# EAGLE design board (EAGLE 9.6.2)
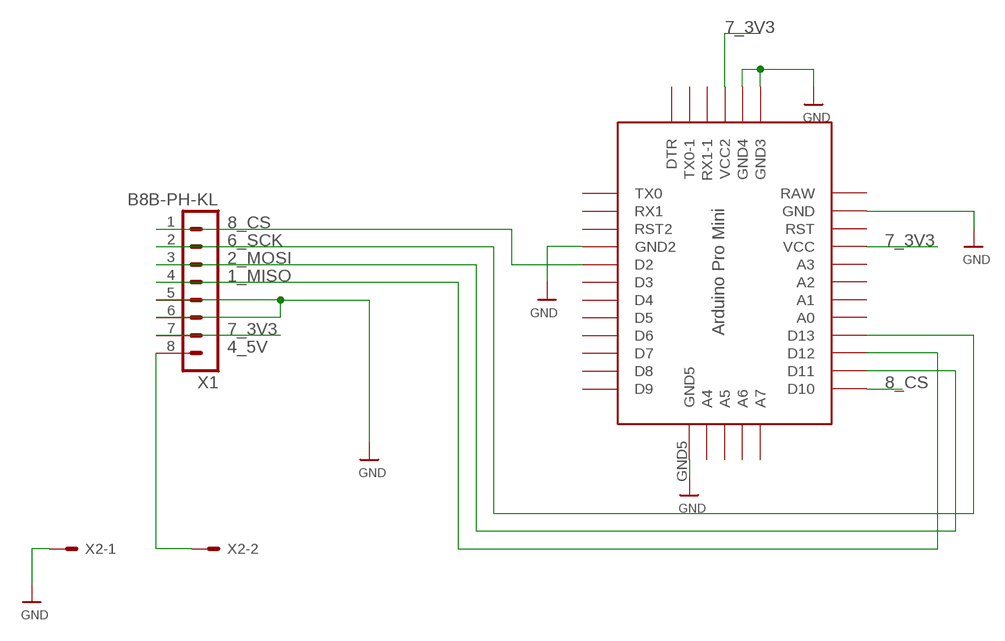
[diagram p0: schematic, sheet 1]

## Parts
U$7  PRO-MINI_5BOT  [PRO-MINI-5BOT]
X1  B8B-PH-KL  [B8B-PH-K-S]
X2  87758-0216  [87758-0216]

## Nets
1_MISO: U$7.D12 X1.4
2_MOSI: U$7.D11 X1.3
4_5V: X1.8 X2.2
6_SCK: U$7.D13 X1.2
7_3V3: U$7.VCC U$7.VCC2 X1.7
8_CS: U$7.D2 U$7.D10 X1.1
GND: U$7.GND U$7.GND2 U$7.GND3 U$7.GND4 U$7.GND5 X1.5 X1.6 X2.1
Unconnected: U$7.A0 U$7.A1 U$7.A2 U$7.A3 U$7.A4 U$7.A5 U$7.A6 U$7.A7 U$7.D3 U$7.D4 U$7.D5 U$7.D6 U$7.D7 U$7.D8 U$7.D9 U$7.DTR U$7.RST U$7.RST2 U$7.RX1 U$7.RX1-1 U$7.TX0 U$7.TX0-1

## Power pins joined to a net without a drawn wire
RAW: U$7.RAW

## Library data of the parts
U$7 = Arduino-clone:PRO-MINI_5BOT: 5 pins at bottom
X1 = con-JST PH:B8B-PH: JST PH series header 2.00mm pitch disconnectable crimp style connectors, vertical (side entry type), 8 pins
X2 = con-molex:87758-0216: 2 Pin - 2mm Dual Row Single Wafer, Vertical T/H HDR Source: http://www.molex.com/pdm_docs/sd/877580616_sd.pdf; MF: MOLEX; MPN: 87758-0216; OC_FARNELL: unknown; OC_NEWARK: 94M1513

## Board
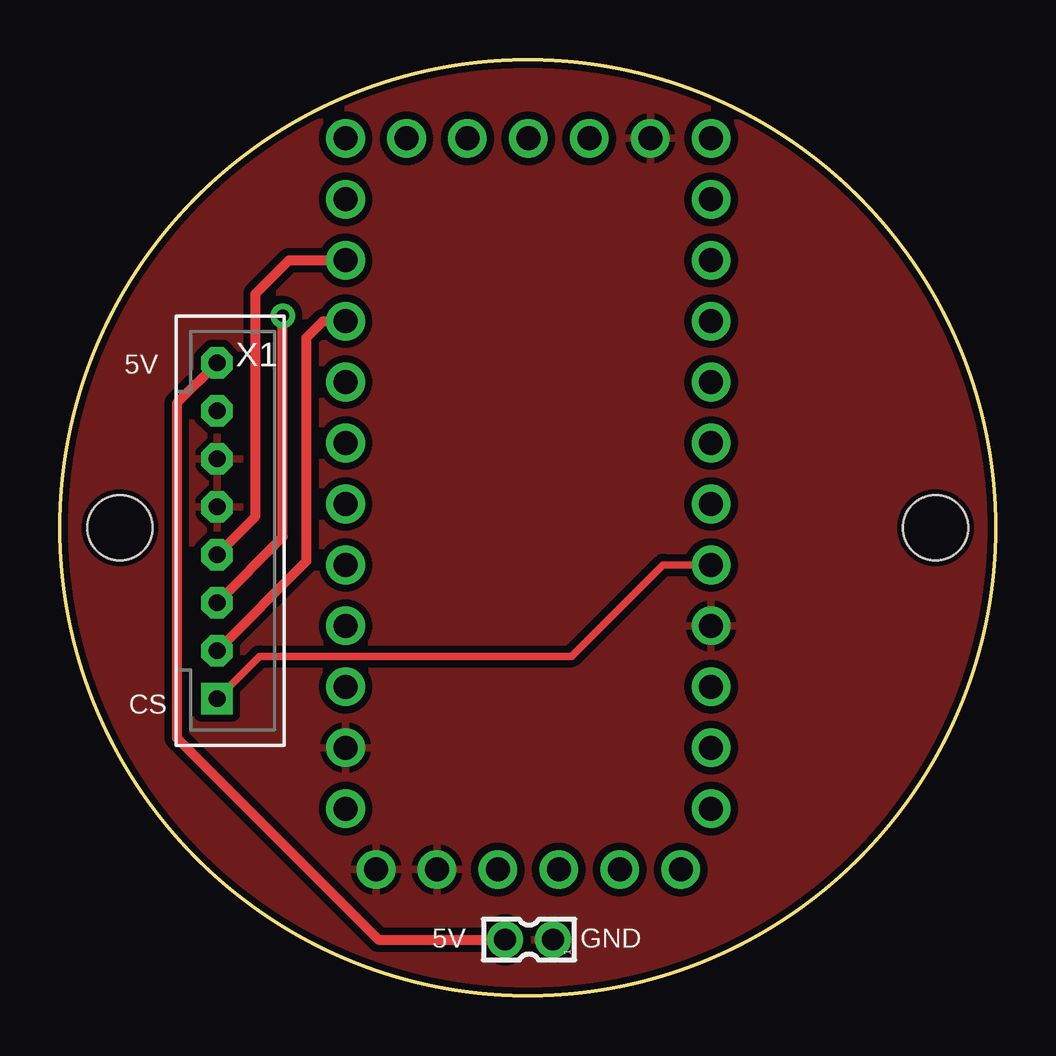
[diagram p1: board, top side]
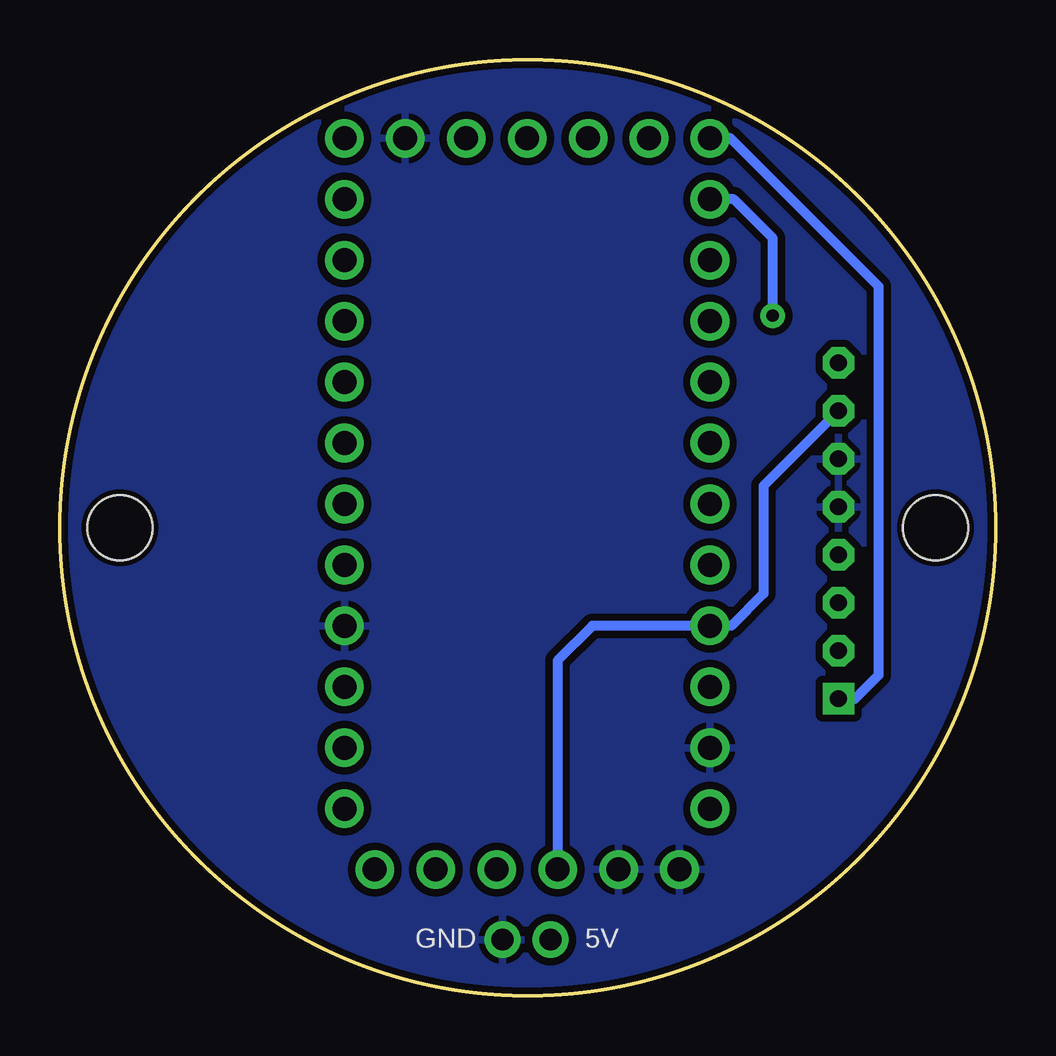
[diagram p2: board, bottom side, seen from below]

Size 39 x 39 mm. Coordinates in mm from the lower left corner, seen from the top.
Outline: circle at 19.5,19.5 radius 19.5
Copper layers (1*16): Top 0.035mm / dielectric 1.6mm / Bottom 0.035mm
Design rules "SparkFun_12mil *": minimum track width 8mil, minimum drill 20mil, track to track 12mil, track to pad 12mil, pad to pad 10mil, via to via 12mil, smd to smd 8mil, copper to edge 10mil, drill to drill 8mil, minimum pad ring 12mil, minimum via ring 10mil, stop-mask expansion 4mil, vias tented up to drill 25mil, thermal gap 10mil
Holes 2.7 mm at 2.5,19.5 36.5,19.5

### Footprints (pad centres in the part's own frame; a part is rotated, then mirrored left to right if it is on the bottom)
PRO-MINI-5BOT = drill 1: A0 8.89,8.89; A1 8.89,11.43; A2 8.89,13.97; A3 8.89,16.51; A4 -1.27,-1.27; A5 1.27,-1.27; A6 3.81,-1.27; A7 6.35,-1.27; D2 -6.35,16.51; D3 -6.35,13.97; D4 -6.35,11.43; D5 -6.35,8.89; D6 -6.35,6.35; D7 -6.35,3.81; D8 -6.35,1.27; D9 -6.35,-1.27; D10 8.89,-1.27; D11 8.89,1.27; D12 8.89,3.81; D13 8.89,6.35; DTR -5.08,29.21; GND 8.89,24.13; GND2 -6.35,19.05; GND3 7.62,29.21; GND4 5.08,29.21; GND5 -3.81,-1.27; RAW 8.89,26.67; RST 8.89,21.59; RST2 -6.35,21.59; RX1 -6.35,24.13; RX1-1 0,29.21; TX0 -6.35,26.67; TX0-1 -2.54,29.21; VCC 8.89,19.05; VCC2 2.54,29.21
B8B-PH-K-S = drill 0.7 pad 1.3 square: 1 7,0 | drill 0.7 pad 1.3 octagon: 2 5,0; 3 3,0; 4 1,0; 5 -1,0; 6 -3,0; 7 -5,0; 8 -7,0
87758-0216 = drill 0.9 pad 1.27: 1 0,-1; 2 0,1

### Placement (x,y rotation side)
U$7  20.8,34.46 180 top
X1  6.55,19.37 270 top
X2  19.55,2.33 90 top

### Tracks (layer width: path | path; a pad name or v marks a point on that pad's centre or on a via)
1_MISO
  Top 0.406: X1.4 8.15,19.97 8.15,29.25 9.54,30.65 U$7.D12
2_MOSI  (via drill 0.51)
  Top 0.406: X1.3 9.29,19.12 v9.29,28.34
  Bottom 0.406: v9.29,28.34 9.29,31.56 10.91,33.19 U$7.D11
4_5V
  Top 0.406: X1.8 4.87,24.7 4.87,10.74 13.28,2.33 X2.2
6_SCK
  Top 0.406: X1.2 10.28,18.11 10.28,27.43 10.97,28.11 U$7.D13
7_3V3
  Bottom 0.406: X1.7 9.67,21.25 9.67,16.76 11.02,15.41 U$7.VCC 16.81,15.41 18.25,13.96 U$7.VCC2
8_CS
  Top 0.305: X1.1 8.31,14.14 21.33,14.14 25.14,17.95 U$7.D2
  Bottom 0.406: X1.1 5.86,12.37 4.87,13.36 4.87,29.56 11.04,35.73 U$7.D10
GND
  pour Top: -7.42,42.87 -7.42,-5.14 42.61,-5.14 42.61,42.87
  pour Bottom: -7.42,42.87 -7.42,-5.14 42.61,-5.14 42.61,42.87

### Text on the board
tPlace: 5V | CS | 5V | GND
bPlace: 5V | GND